# Altium schematic sheet STM32F4xxZ.SchDoc
size 297 x 209 mm
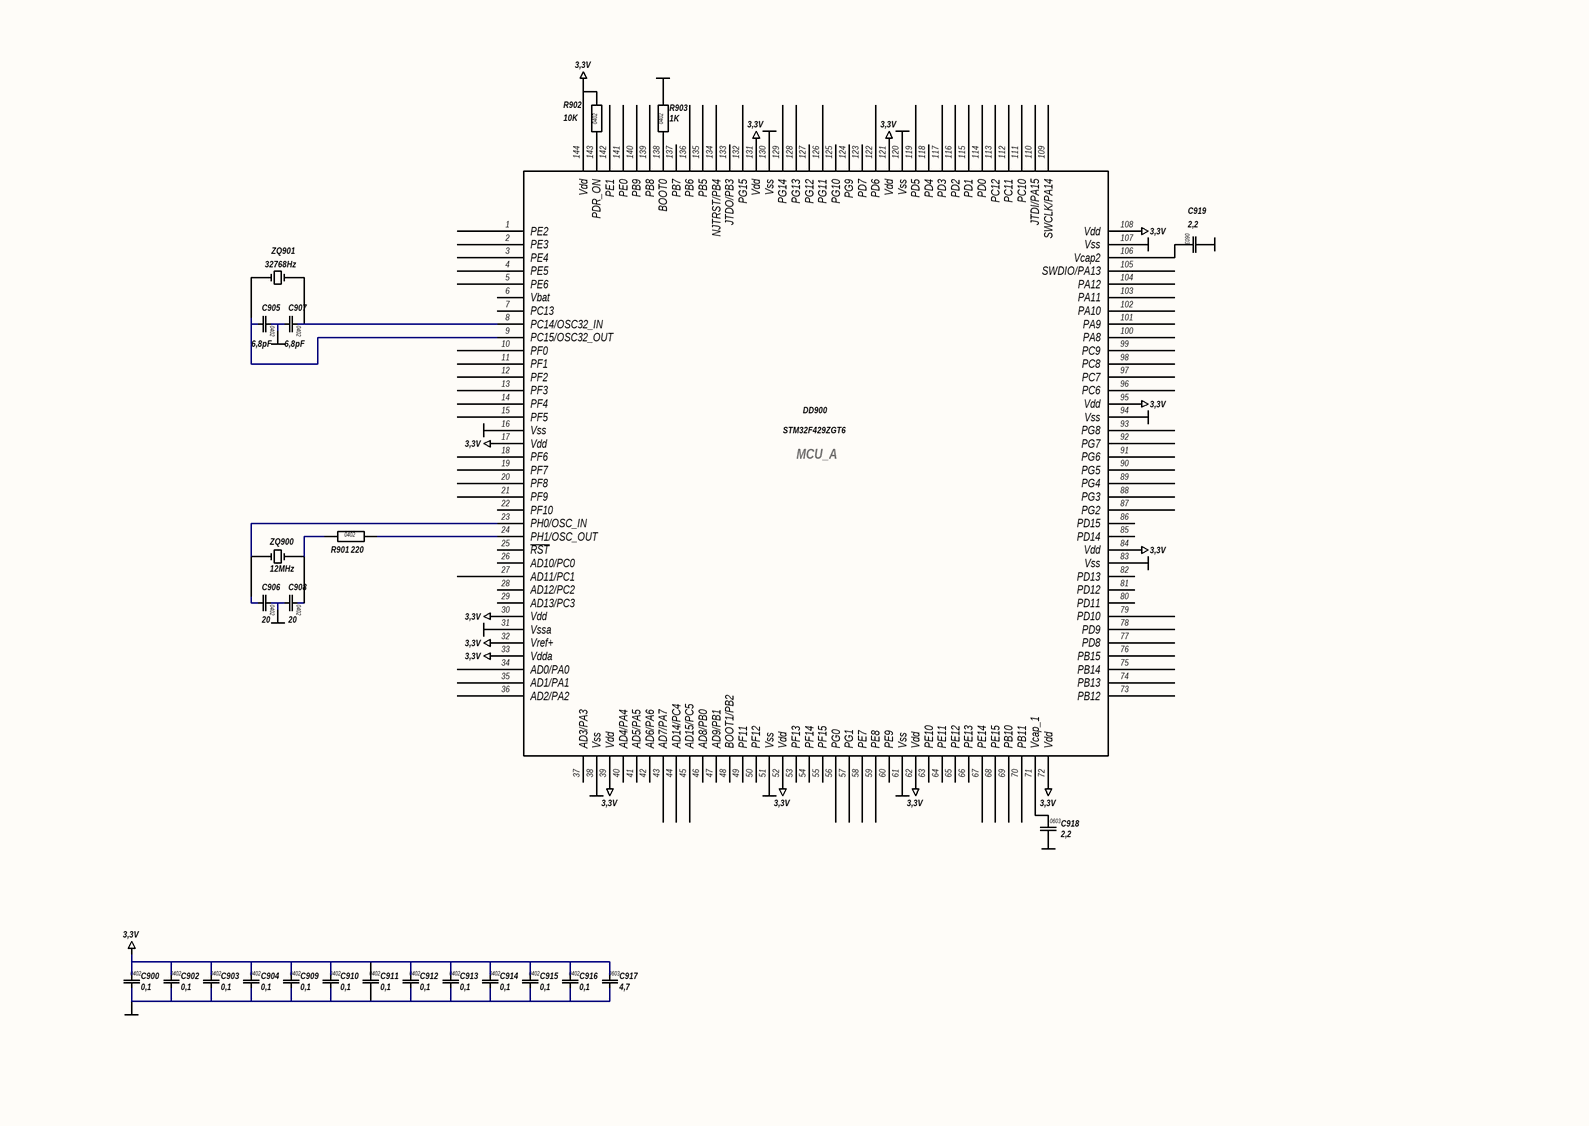
[diagram p0: STM32F4xxZ.SchDoc]

## Parts
C900  0,1  [CAP0402]
C902  0,1  [CAP0402]
C903  0,1  [CAP0402]
C904  0,1  [CAP0402]
C905  6,8pF  [CAP0402]
C906  20  [CAP0402]
C907  6,8pF  [CAP0402]
C908  20  [CAP0402]
C909  0,1  [CAP0402]
C910  0,1  [CAP0402]
C911  0,1  [CAP0402]
C912  0,1  [CAP0402]
C913  0,1  [CAP0402]
C914  0,1  [CAP0402]
C915  0,1  [CAP0402]
C916  0,1  [CAP0402]
C917  4,7  [CAP0603]
C918  2,2  [CAP0603]
C919  2,2  [CAP0603]
DD900  STM32F429ZGT6  [LQFP144]
R901  220  [RES0402]
R902  10K  [RES0402]
R903  1K  [RES0402]
ZQ900  12MHz  [KX-7]
ZQ901  32768Hz  [OSC РК206 AA SMD]

## Nets
3,3V: C900.1 C902.1 C903.1 C904.1 C909.1 C910.1 C911.1 C912.1 C913.1 C914.1 C915.1 C916.1 C917.1 DD900.17(Vdd) DD900.30(Vdd) DD900.32(Vref+) DD900.33(Vdda) DD900.39(Vdd) DD900.52(Vdd) DD900.62(Vdd) DD900.72(Vdd) DD900.84(Vdd) DD900.95(Vdd) DD900.108(Vdd) DD900.121(Vdd) DD900.131(Vdd) DD900.144(Vdd) R902.2
GND: C900.2 C902.2 C903.2 C904.2 C905.1 C906.1 C907.2 C908.2 C909.2 C910.2 C911.2 C912.2 C913.2 C914.2 C915.2 C916.2 C917.2 C918.2 C919.2 DD900.16(Vss) DD900.31(Vssa) DD900.38(Vss) DD900.51(Vss) DD900.61(Vss) DD900.83(Vss) DD900.94(Vss) DD900.107(Vss) DD900.120(Vss) DD900.130(Vss) R903.2
NetC905_2: C905.2 DD900.9(PC15/OSC32_OUT) ZQ901.2
NetC906_2: C906.2 DD900.23(PH0/OSC_IN) ZQ900.3
NetC907_1: C907.1 DD900.8(PC14/OSC32_IN) ZQ901.1
NetC908_1: C908.1 R901.1 ZQ900.1
NetC918_1: C918.1 DD900.71(Vcap_1)
NetC919_1: C919.1 DD900.106(Vcap2)
NetDD900_24: DD900.24(PH1/OSC_OUT) R901.2
NetDD900_138: DD900.138(BOOT0) R903.1
NetDD900_143: DD900.143(PDR_ON) R902.1

Not connected (* = marked no-connect by the designer): DD900 1(PE2) 2(PE3) 3(PE4) 4(PE5) 5(PE6) 6(Vbat) 7(PC13) 10(PF0) 11(PF1) 12(PF2) 13(PF3) 14(PF4) 15(PF5) 18(PF6) 19(PF7) 20(PF8) 21(PF9) 22(PF10) 25(~{RST}) 26(AD10/PC0) 27(AD11/PC1) 28(AD12/PC2) 29(AD13/PC3) 34(AD0/PA0) 35(AD1/PA1) 36(AD2/PA2) 37(AD3/PA3) 40(AD4/PA4) 41(AD5/PA5) 42(AD6/PA6) 43(AD7/PA7) 44(AD14/PC4) 45(AD15/PC5) 46(AD8/PB0) 47(AD9/PB1) 48(BOOT1/PB2) 49(PF11) 50(PF12) 53(PF13) 54(PF14) 55(PF15) 56(PG0) 57(PG1) 58(PE7) 59(PE8) 60(PE9) 63(PE10) 64(PE11) 65(PE12) 66(PE13) 67(PE14) 68(PE15) 69(PB10) 70(PB11) 73(PB12) 74(PB13) 75(PB14) 76(PB15) 77(PD8) 78(PD9) 79(PD10) 80(PD11) 81(PD12) 82(PD13) 85(PD14) 86(PD15) 87(PG2) 88(PG3) 89(PG4) 90(PG5) 91(PG6) 92(PG7) 93(PG8) 96(PC6) 97(PC7) 98(PC8) 99(PC9) 100(PA8) 101(PA9) 102(PA10) 103(PA11) 104(PA12) 105(SWDIO/PA13) 109(SWCLK/PA14) 110(JTDI/PA15) 111(PC10) 112(PC11) 113(PC12) 114(PD0) 115(PD1) 116(PD2) 117(PD3) 118(PD4) 119(PD5) 122(PD6) 123(PD7) 124(PG9) 125(PG10) 126(PG11) 127(PG12) 128(PG13) 129(PG14) 132(PG15) 133(JTDO/PB3) 134(NJTRST/PB4) 135(PB5) 136(PB6) 137(PB7) 139(PB8) 140(PB9) 141(PE0) 142(PE1); ZQ900 2 4

## Notes on the sheet
- (near DD900) MCU_A

## Library data of the parts
C900 C902-C904 C909-C916 = CAP_0402: Конденсатор чип; Тип корпуса: 0402; Тип монтажа: Поверхностный; Номинал: 0,1; Тип компонента: Конденсатор чип
C905-C908 = CAP_0402: Конденсатор чип; Напряжение: 50V; Тип корпуса: 0402; Тип монтажа: Поверхностный; Тип компонента: Конденсатор чип
  C905 C907: Номинал: 6,8pF; Value: 6,8pF
  C906 C908: Номинал: 20; Value: 20
C917-C919 = CAP_0603: Конденсатор чип; Тип корпуса: 0603; Тип монтажа: Поверхностный; Тип компонента: Конденсатор чип
  C917: Номинал: 4,7
  C918 C919: Номинал: 2,2
DD900 = STM32F4xxZ: Микроконтроллер; Производитель: STMicroelectronics; Тип монтажа: Поверхностный; Наименование: STM32F429ZGT6; Тип компонента: Микроконтроллер; Тип корпуса: LQFP144
R901-R903 = RES_0402: Резистор чип; Тип корпуса: 0402; Тип монтажа: Поверхностный; Характеристики: 0.062Вт 50В; Тип компонента: Резистор чип
  R901: Номинал: 220; Value: 220
  R902: Номинал: 10K; Value: 10K
  R903: Номинал: 1K; Value: 1K
ZQ900 = KX-7: Кварц; Тип монтажа: Поверхностный; Производитель: Geyer; Номинал: 12MHz; Тип компонента: Кварц; Тип корпуса: KX-7
ZQ901 = OSC РК206 AA 32.768KHZ: Кварц; Тип корпуса: PK206 AA; Тип монтажа: Поверхностный; Номинал: 32768Hz; Тип компонента: Кварц